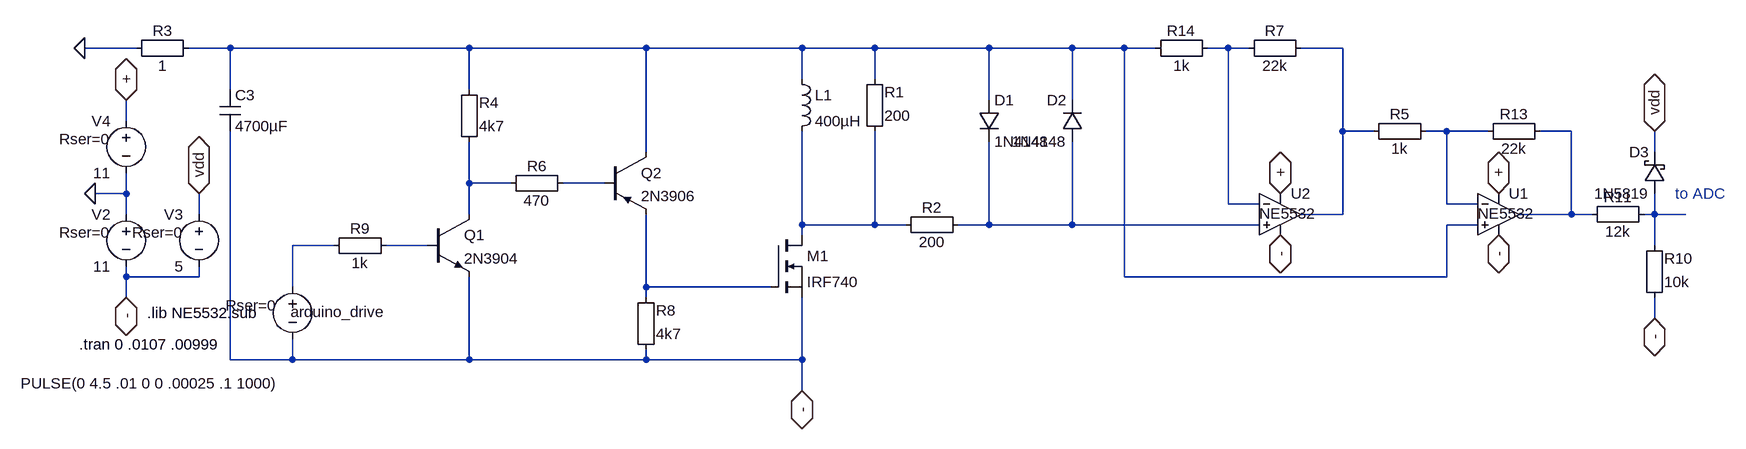
[diagram p0: schematic meat_haw_101.asc]
meat_haw_101.asc, the LTspice schematic file:
Version 4
SHEET 1 4676 1612
WIRE -112 -2400 -192 -2400
WIRE 32 -2400 -32 -2400
WIRE 400 -2400 32 -2400
WIRE 672 -2400 400 -2400
WIRE 912 -2400 672 -2400
WIRE 1024 -2400 912 -2400
WIRE 1200 -2400 1024 -2400
WIRE 1328 -2400 1200 -2400
WIRE 1408 -2400 1328 -2400
WIRE 1456 -2400 1408 -2400
WIRE 1568 -2400 1536 -2400
WIRE 1600 -2400 1568 -2400
WIRE 1744 -2400 1680 -2400
WIRE 912 -2352 912 -2400
WIRE 1024 -2352 1024 -2400
WIRE 32 -2336 32 -2400
WIRE 400 -2336 400 -2400
WIRE 1200 -2320 1200 -2400
WIRE 1328 -2320 1328 -2400
WIRE -128 -2288 -128 -2320
WIRE 1744 -2272 1744 -2400
WIRE 1792 -2272 1744 -2272
WIRE 1904 -2272 1872 -2272
WIRE 1968 -2272 1904 -2272
WIRE 2096 -2272 2048 -2272
WIRE 672 -2240 672 -2400
WIRE 2224 -2240 2224 -2272
WIRE 400 -2192 400 -2256
WIRE 464 -2192 400 -2192
WIRE 608 -2192 544 -2192
WIRE -128 -2176 -128 -2208
WIRE -128 -2176 -176 -2176
WIRE 1568 -2160 1568 -2400
WIRE 1616 -2160 1568 -2160
WIRE 1904 -2160 1904 -2272
WIRE 1952 -2160 1904 -2160
WIRE -128 -2144 -128 -2176
WIRE -16 -2144 -16 -2176
WIRE 400 -2144 400 -2192
WIRE 1744 -2144 1744 -2272
WIRE 1744 -2144 1680 -2144
WIRE 2096 -2144 2096 -2272
WIRE 2096 -2144 2016 -2144
WIRE 2128 -2144 2096 -2144
WIRE 2224 -2144 2224 -2176
WIRE 2224 -2144 2208 -2144
WIRE 2272 -2144 2224 -2144
WIRE 912 -2128 912 -2272
WIRE 1024 -2128 1024 -2272
WIRE 1024 -2128 912 -2128
WIRE 1072 -2128 1024 -2128
WIRE 1200 -2128 1200 -2256
WIRE 1200 -2128 1152 -2128
WIRE 1328 -2128 1328 -2256
WIRE 1328 -2128 1200 -2128
WIRE 1616 -2128 1328 -2128
WIRE 1952 -2128 1904 -2128
WIRE 912 -2112 912 -2128
WIRE 192 -2096 128 -2096
WIRE 336 -2096 272 -2096
WIRE 2224 -2096 2224 -2144
WIRE -128 -2048 -128 -2064
WIRE -16 -2048 -16 -2064
WIRE -16 -2048 -128 -2048
WIRE 1408 -2048 1408 -2400
WIRE 1904 -2048 1904 -2128
WIRE 1904 -2048 1408 -2048
WIRE 128 -2032 128 -2096
WIRE 672 -2032 672 -2144
WIRE 864 -2032 672 -2032
WIRE -128 -2016 -128 -2048
WIRE 672 -2016 672 -2032
WIRE 2224 -1984 2224 -2016
WIRE 32 -1920 32 -2272
WIRE 128 -1920 128 -1952
WIRE 128 -1920 32 -1920
WIRE 400 -1920 400 -2048
WIRE 400 -1920 128 -1920
WIRE 672 -1920 672 -1936
WIRE 672 -1920 400 -1920
WIRE 912 -1920 912 -2016
WIRE 912 -1920 672 -1920
WIRE 912 -1872 912 -1920
FLAG 912 -1872 -
IOPIN 912 -1872 BiDir
FLAG -128 -2016 -
IOPIN -128 -2016 BiDir
FLAG -128 -2320 +
IOPIN -128 -2320 BiDir
FLAG -176 -2176 0
FLAG -192 -2400 0
FLAG -16 -2176 vdd
IOPIN -16 -2176 BiDir
FLAG 1648 -2176 +
IOPIN 1648 -2176 BiDir
FLAG 1648 -2112 -
IOPIN 1648 -2112 BiDir
FLAG 1984 -2176 +
IOPIN 1984 -2176 BiDir
FLAG 1984 -2112 -
IOPIN 1984 -2112 BiDir
FLAG 2224 -1984 -
IOPIN 2224 -1984 BiDir
FLAG 2224 -2272 vdd
IOPIN 2224 -2272 BiDir
SYMBOL Misc\\EuropeanCap 16 -2336 R0
SYMATTR InstName C3
SYMATTR Value 4700µF
SYMATTR SpiceLine V=400 Irms=1 Rser=.32 Lser=0
SYMBOL ind 896 -2368 R0
SYMATTR InstName L1
SYMATTR Value 400µH
SYMBOL Misc\\EuropeanResistor 1008 -2256 M180
WINDOW 0 31 76 Left 2
WINDOW 3 31 40 Left 2
SYMATTR InstName R1
SYMATTR Value 200
SYMBOL Misc\\EuropeanResistor 1056 -2144 M90
WINDOW 0 5 56 VBottom 2
WINDOW 3 27 56 VTop 2
SYMATTR InstName R2
SYMATTR Value 200
SYMBOL diode 1184 -2320 R0
SYMATTR InstName D1
SYMATTR Value 1N4148
SYMBOL diode 1344 -2256 R180
WINDOW 0 24 64 Left 2
WINDOW 3 24 0 Left 2
SYMATTR InstName D2
SYMATTR Value 1N4148
SYMBOL Misc\\EuropeanResistor -128 -2416 M90
WINDOW 0 5 56 VBottom 2
WINDOW 3 27 56 VTop 2
SYMATTR InstName R3
SYMATTR Value 1
SYMBOL nmos 864 -2112 R0
SYMATTR InstName M1
SYMATTR Value IRF740
SYMBOL voltage 128 -2048 M0
WINDOW 123 0 0 Left 2
WINDOW 39 24 44 Left 2
WINDOW 0 -144 54 Left 2
WINDOW 3 20 164 Left 2
SYMATTR SpiceLine Rser=0
SYMATTR InstName arduino_drive
SYMATTR Value PULSE(0 4.5 .01 0 0 .00025 .1 1000)
SYMBOL voltage -128 -2160 M0
WINDOW 123 0 0 Left 2
WINDOW 39 24 44 Left 2
SYMATTR SpiceLine Rser=0
SYMATTR InstName V2
SYMATTR Value 11
SYMBOL voltage -128 -2304 M0
WINDOW 123 0 0 Left 2
WINDOW 39 24 44 Left 2
SYMATTR SpiceLine Rser=0
SYMATTR InstName V4
SYMATTR Value 11
SYMBOL voltage -16 -2160 M0
WINDOW 123 0 0 Left 2
WINDOW 39 24 44 Left 2
SYMATTR SpiceLine Rser=0
SYMATTR InstName V3
SYMATTR Value 5
SYMBOL npn3 336 -2144 R0
SYMATTR InstName Q1
SYMATTR Value 2N3904
SYMBOL Misc\\EuropeanResistor 384 -2240 M180
WINDOW 0 31 76 Left 2
WINDOW 3 31 40 Left 2
SYMATTR InstName R4
SYMATTR Value 4k7
SYMBOL pnp2 608 -2240 R0
SYMATTR InstName Q2
SYMATTR Value 2N3906
SYMBOL Misc\\EuropeanResistor 656 -1920 M180
WINDOW 0 31 76 Left 2
WINDOW 3 31 40 Left 2
SYMATTR InstName R8
SYMATTR Value 4k7
SYMBOL Misc\\EuropeanResistor 176 -2112 M90
WINDOW 0 5 56 VBottom 2
WINDOW 3 27 56 VTop 2
SYMATTR InstName R9
SYMATTR Value 1k
SYMBOL Misc\\EuropeanResistor 448 -2208 M90
WINDOW 0 5 56 VBottom 2
WINDOW 3 27 56 VTop 2
SYMATTR InstName R6
SYMATTR Value 470
SYMBOL Opamps\\opamp2 1648 -2208 R0
WINDOW 3 -32 63 Left 2
SYMATTR Value NE5532
SYMATTR InstName U2
SYMBOL Misc\\EuropeanResistor 1952 -2256 R270
WINDOW 0 27 56 VTop 2
WINDOW 3 5 56 VBottom 2
SYMATTR InstName R13
SYMATTR Value 22k
SYMBOL Misc\\EuropeanResistor 1440 -2384 R270
WINDOW 0 27 56 VTop 2
WINDOW 3 5 56 VBottom 2
SYMATTR InstName R14
SYMATTR Value 1k
SYMBOL Opamps\\opamp2 1984 -2208 R0
WINDOW 3 -32 63 Left 2
SYMATTR Value NE5532
SYMATTR InstName U1
SYMBOL Misc\\EuropeanResistor 1776 -2256 R270
WINDOW 0 27 56 VTop 2
WINDOW 3 5 56 VBottom 2
SYMATTR InstName R5
SYMATTR Value 1k
SYMBOL Misc\\EuropeanResistor 1584 -2384 R270
WINDOW 0 27 56 VTop 2
WINDOW 3 5 56 VBottom 2
SYMATTR InstName R7
SYMATTR Value 22k
SYMBOL Misc\\EuropeanResistor 2112 -2128 R270
WINDOW 0 27 56 VTop 2
WINDOW 3 5 56 VBottom 2
SYMATTR InstName R11
SYMATTR Value 12k
SYMBOL Misc\\EuropeanResistor 2208 -2000 M180
WINDOW 0 31 76 Left 2
WINDOW 3 31 40 Left 2
SYMATTR InstName R10
SYMATTR Value 10k
SYMBOL schottky 2240 -2176 R180
WINDOW 0 24 64 Left 2
WINDOW 3 24 0 Left 2
SYMATTR InstName D3
SYMATTR Value 1N5819
SYMATTR Description Diode
SYMATTR Type diode
TEXT -200 -1944 Left 2 !.tran 0 .0107 .00999
TEXT -96 -1992 Left 2 !.lib NE5532.sub
TEXT 2256 -2176 Left 2 ;to ADC

The netlist it stands for:
* meat_haw_101.asc
C3 N001 - 4700µF V=400 Irms=1 Rser=.32 Lser=0
L1 N001 N009 400µH
R1 N009 N001 200
R2 N009 N010 200
D1 N001 N010 1N4148
D2 N010 N001 1N4148
R3 0 N001 1
M1 N009 N013 - - IRF740
V§arduino_drive N011 - PULSE(0 4.5 .01 0 0 .00025 .1 1000) Rser=0
V2 0 - 11 Rser=0
V4 + 0 11 Rser=0
V3 vdd - 5 Rser=0
Q1 N006 N012 - 0 2N3904
R4 N006 N001 4k7
Q2 N001 N007 N013 0 2N3906
R8 - N013 4k7
R9 N011 N012 1k
R6 N006 N007 470
XU2 N010 N002 + - N003 NE5532  ; pins In+ In- V+ V- OUT
R13 N004 N005 22k
R14 N001 N002 1k
XU1 N001 N004 + - N005 NE5532  ; pins In+ In- V+ V- OUT
R5 N003 N004 1k
R7 N002 N003 22k
R11 N005 N008 12k
R10 - N008 10k
D3 N008 vdd 1N5819
.model D D
.lib standard.dio
.model NPN NPN
.model PNP PNP
.lib standard.bjt
.model NMOS NMOS
.model PMOS PMOS
.lib standard.mos
.tran 0 .0107 .00999
.lib NE5532.sub
* to ADC
.backanno
.end